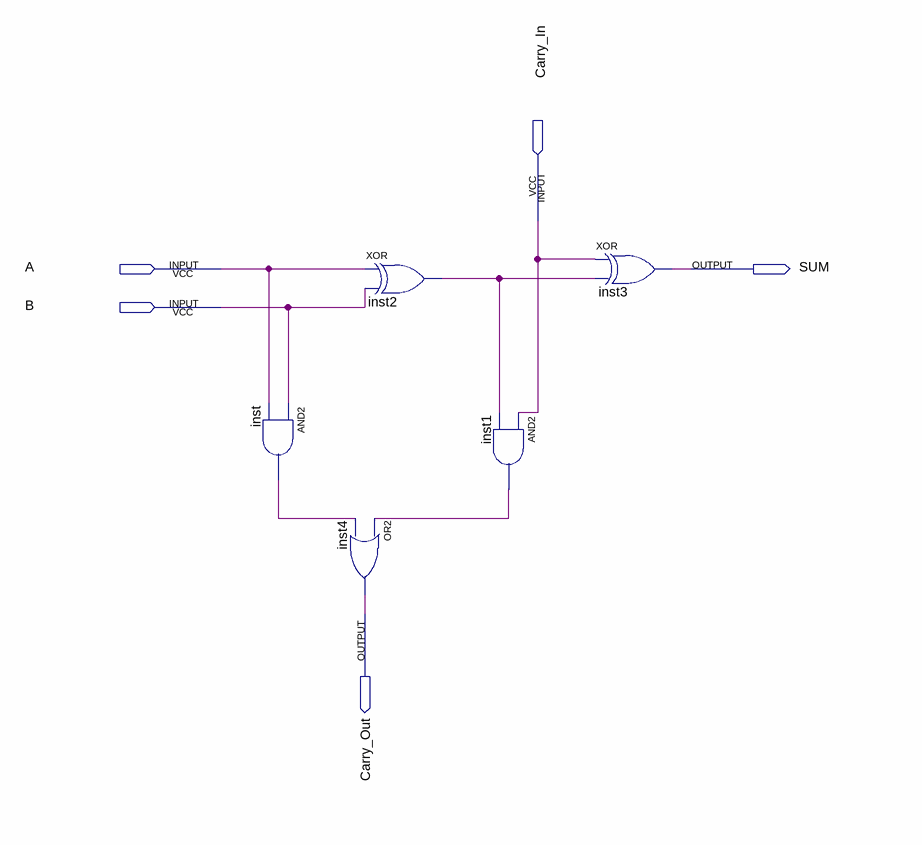
[diagram p0: schematic sheet]
// Quartus schematic FULL_ADER_1BIT.bdf as structural Verilog: 5 symbols, 5 pins
module FULL_ADER_1BIT (
  input  Carry_In,
  input  A,
  input  B,
  output SUM,
  output Carry_Out
);

  wire inst1_out, inst2_out, inst_out;

  and inst (inst_out, B, A);
  xor inst2 (inst2_out, A, B);
  or inst4 (Carry_Out, inst1_out, inst_out);
  and inst1 (inst1_out, Carry_In, inst2_out);
  xor inst3 (SUM, Carry_In, inst2_out);
endmodule
